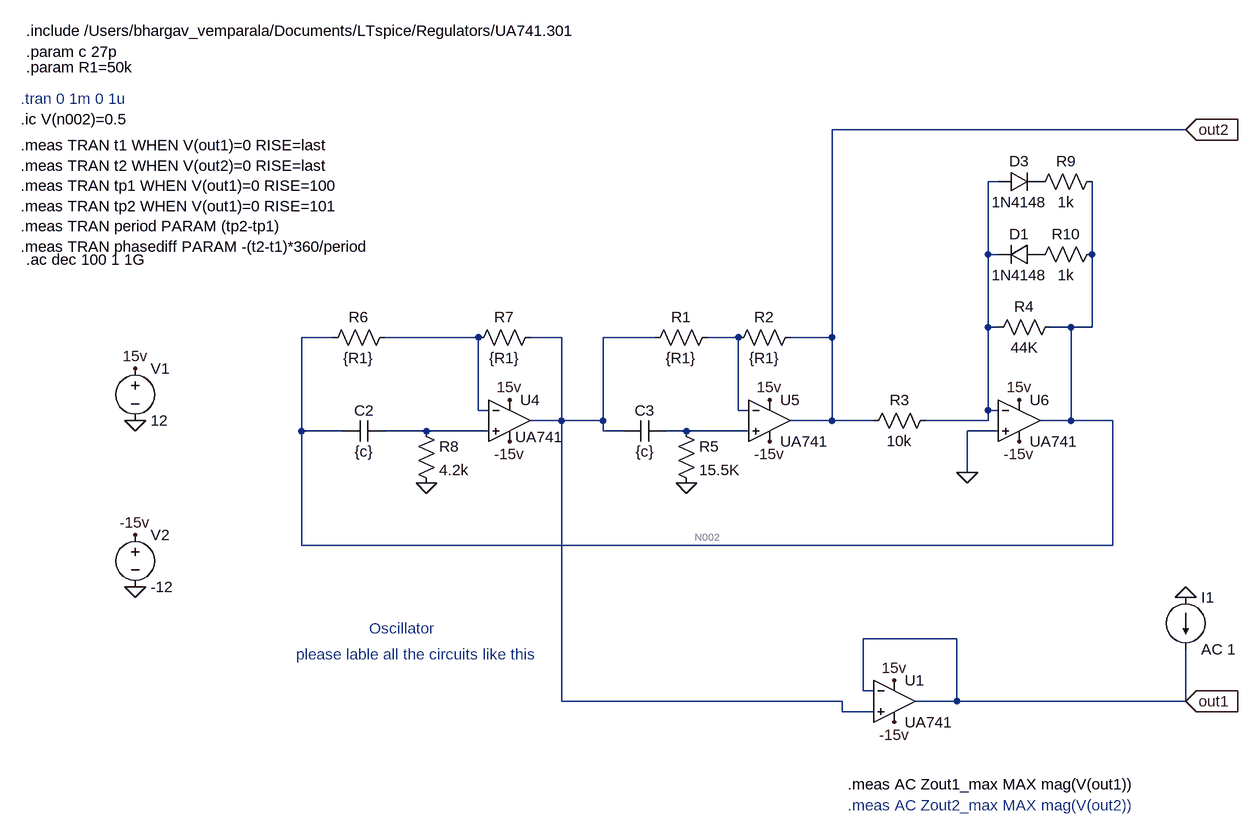
[diagram p0: schematic QDC.asc]
QDC.asc, the LTspice schematic file:
Version 4.1
SHEET 1 1168 752
WIRE 1056 -304 512 -304
WIRE 768 -224 752 -224
WIRE 752 -112 752 -224
WIRE 768 -112 752 -112
WIRE 912 -112 912 -224
WIRE 752 0 752 -112
WIRE 768 0 752 0
WIRE 880 0 848 0
WIRE 912 0 912 -112
WIRE 912 0 880 0
WIRE -256 16 -304 16
WIRE -32 16 -176 16
WIRE 96 16 48 16
WIRE 240 16 160 16
WIRE 368 16 320 16
WIRE 512 16 512 -304
WIRE 512 16 448 16
WIRE -32 128 -32 16
WIRE -16 128 -32 128
WIRE 368 128 368 16
WIRE 384 128 368 128
WIRE 752 128 752 0
WIRE 768 128 752 128
WIRE 96 144 96 16
WIRE 96 144 48 144
WIRE 160 144 160 16
WIRE 160 144 96 144
WIRE 512 144 512 16
WIRE 512 144 448 144
WIRE 576 144 512 144
WIRE 752 144 752 128
WIRE 752 144 656 144
WIRE 880 144 880 0
WIRE 880 144 832 144
WIRE 944 144 880 144
WIRE -304 160 -304 16
WIRE -240 160 -304 160
WIRE -112 160 -176 160
WIRE -16 160 -112 160
WIRE 160 160 160 144
WIRE 192 160 160 160
WIRE 288 160 256 160
WIRE 384 160 288 160
WIRE 768 160 720 160
WIRE 720 224 720 160
WIRE -304 336 -304 160
WIRE 944 336 944 144
WIRE 944 336 -304 336
WIRE 704 480 560 480
WIRE 560 560 560 480
WIRE 576 560 560 560
WIRE 96 576 96 144
WIRE 528 576 96 576
WIRE 704 576 704 480
WIRE 704 576 640 576
WIRE 1056 576 1056 496
WIRE 1056 576 704 576
WIRE 528 592 528 576
WIRE 576 592 528 592
FLAG 720 224 0
FLAG 288 240 0
FLAG -112 240 0
FLAG -560 64 15v
FLAG 16 112 15v
FLAG 416 112 15v
FLAG 800 112 15v
FLAG -560 320 -15v
FLAG 800 176 -15v
FLAG -560 144 0
FLAG -560 400 0
FLAG 16 176 -15v
FLAG 416 176 -15v
FLAG 1056 576 out1
IOPIN 1056 576 In
FLAG 1056 -304 out2
IOPIN 1056 -304 In
FLAG 1056 416 0
FLAG 608 544 15v
FLAG 608 608 -15v
SYMBOL res 336 0 R90
WINDOW 0 0 56 VBottom 2
WINDOW 3 32 56 VTop 2
SYMATTR InstName R1
SYMATTR Value {R1}
SYMBOL res 464 0 R90
WINDOW 0 0 56 VBottom 2
WINDOW 3 32 56 VTop 2
SYMATTR InstName R2
SYMATTR Value {R1}
SYMBOL res 672 128 R90
WINDOW 0 0 56 VBottom 2
WINDOW 3 32 56 VTop 2
SYMATTR InstName R3
SYMATTR Value 10k
SYMBOL res 864 -16 R90
WINDOW 0 0 56 VBottom 2
WINDOW 3 32 56 VTop 2
SYMATTR InstName R4
SYMATTR Value 44K
SYMBOL res 272 144 R0
SYMATTR InstName R5
SYMATTR Value 15.5K
SYMBOL res -160 0 R90
WINDOW 0 0 56 VBottom 2
WINDOW 3 32 56 VTop 2
SYMATTR InstName R6
SYMATTR Value {R1}
SYMBOL res 64 0 R90
WINDOW 0 0 56 VBottom 2
WINDOW 3 32 56 VTop 2
SYMATTR InstName R7
SYMATTR Value {R1}
SYMBOL cap -176 144 R90
WINDOW 0 0 32 VBottom 2
WINDOW 3 32 32 VTop 2
SYMATTR InstName C2
SYMATTR Value {c}
SYMBOL res -128 144 R0
SYMATTR InstName R8
SYMATTR Value 4.2k
SYMBOL voltage -560 48 R0
SYMATTR InstName V1
SYMATTR Value 12
SYMBOL voltage -560 304 R0
WINDOW 123 0 0 Left 0
WINDOW 39 0 0 Left 0
SYMATTR InstName V2
SYMATTR Value -12
SYMBOL opamp\\UA741 16 80 R0
WINDOW 3 9 89 Left 2
SYMATTR InstName U4
SYMBOL opamp\\UA741 416 80 R0
SYMATTR InstName U5
SYMBOL opamp\\UA741 800 80 R0
SYMATTR InstName U6
SYMBOL cap 256 144 R90
WINDOW 0 0 32 VBottom 2
WINDOW 3 32 32 VTop 2
SYMATTR InstName C3
SYMATTR Value {c}
SYMBOL diode 832 -128 R90
WINDOW 0 0 32 VBottom 2
WINDOW 3 32 32 VTop 2
SYMATTR InstName D1
SYMATTR Value 1N4148
SYMBOL diode 768 -208 R270
WINDOW 0 32 32 VTop 2
WINDOW 3 0 32 VBottom 2
SYMATTR InstName D3
SYMATTR Value 1N4148
SYMBOL res 928 -240 R90
WINDOW 0 0 56 VBottom 2
WINDOW 3 32 56 VTop 2
SYMATTR InstName R9
SYMATTR Value 1k
SYMBOL res 928 -128 R90
WINDOW 0 0 56 VBottom 2
WINDOW 3 32 56 VTop 2
SYMATTR InstName R10
SYMATTR Value 1k
SYMBOL current 1056 416 R0
SYMATTR InstName I1
SYMATTR Value AC 1
SYMBOL opamp\\UA741 608 512 R0
SYMATTR InstName U1
TEXT -728 -456 Left 2 !.include /Users/bhargav_vemparala/Documents/LTspice/Regulators/UA741.301
TEXT -736 -352 Left 2 ;.tran 0 1m 0 1u
TEXT -728 -400 Left 2 !.param R1=50k
TEXT -736 -320 Left 2 !.ic V(n002)=0.5
TEXT -736 -280 Left 2 !.meas TRAN t1 WHEN V(out1)=0 RISE=last\n.meas TRAN t2 WHEN V(out2)=0 RISE=last\n.meas TRAN tp1 WHEN V(out1)=0 RISE=100\n.meas TRAN tp2 WHEN V(out1)=0 RISE=101\n.meas TRAN period PARAM (tp2-tp1)\n.meas TRAN phasediff PARAM -(t2-t1)*360/period
TEXT -728 -424 Left 2 !.param c 27p
TEXT -200 464 Left 2 ;Oscillator
TEXT -312 504 Left 2 ;please lable all the circuits like this
TEXT 536 704 Left 2 !.meas AC Zout1_max MAX mag(V(out1))
TEXT 536 736 Left 2 ;.meas AC Zout2_max MAX mag(V(out2))
TEXT -728 -104 Left 2 !.ac dec 100 1 1G

The netlist it stands for:
* QDC.asc
R1 N005 N004 {R1}
R2 out2 N005 {R1}
R3 N001 out2 10k
R4 N002 N001 44K
R5 N007 0 15.5K
R6 N003 N002 {R1}
R7 N004 N003 {R1}
C2 N006 N002 {c}
R8 N006 0 4.2k
V1 15v 0 12
V2 -15v 0 -12
* U4: UA741 (symbol opamp\UA741 not available, pins judged from their places): In+=N006 In-=N003 V+=15v V-=-15v OUT=N004
* U5: UA741 (symbol opamp\UA741 not available, pins judged from their places): In+=N007 In-=N005 V+=15v V-=-15v OUT=out2
* U6: UA741 (symbol opamp\UA741 not available, pins judged from their places): In+=0 In-=N001 V+=15v V-=-15v OUT=N002
C3 N007 N004 {c}
D1 P001 N001 1N4148
D3 N001 P002 1N4148
R9 N002 P002 1k
R10 N002 P001 1k
I1 0 out1 AC 1
* U1: UA741 (symbol opamp\UA741 not available, pins judged from their places): In+=N004 In-=out1 V+=15v V-=-15v OUT=out1
.model D D
.lib standard.dio
.include /Users/bhargav_vemparala/Documents/LTspice/Regulators/UA741.301
* .tran 0 1m 0 1u
.param R1=50k
.ic V(n002)=0.5
.meas TRAN t1 WHEN V(out1)=0 RISE=last
.meas TRAN t2 WHEN V(out2)=0 RISE=last
.meas TRAN tp1 WHEN V(out1)=0 RISE=100
.meas TRAN tp2 WHEN V(out1)=0 RISE=101
.meas TRAN period PARAM (tp2-tp1)
.meas TRAN phasediff PARAM -(t2-t1)*360/period
.param c 27p
* Oscillator
* please lable all the circuits like this
.meas AC Zout1_max MAX mag(V(out1))
* .meas AC Zout2_max MAX mag(V(out2))
.ac dec 100 1 1G
.backanno
.end